# Altium schematic sheet STM8L-Controller.SchDoc
size A2
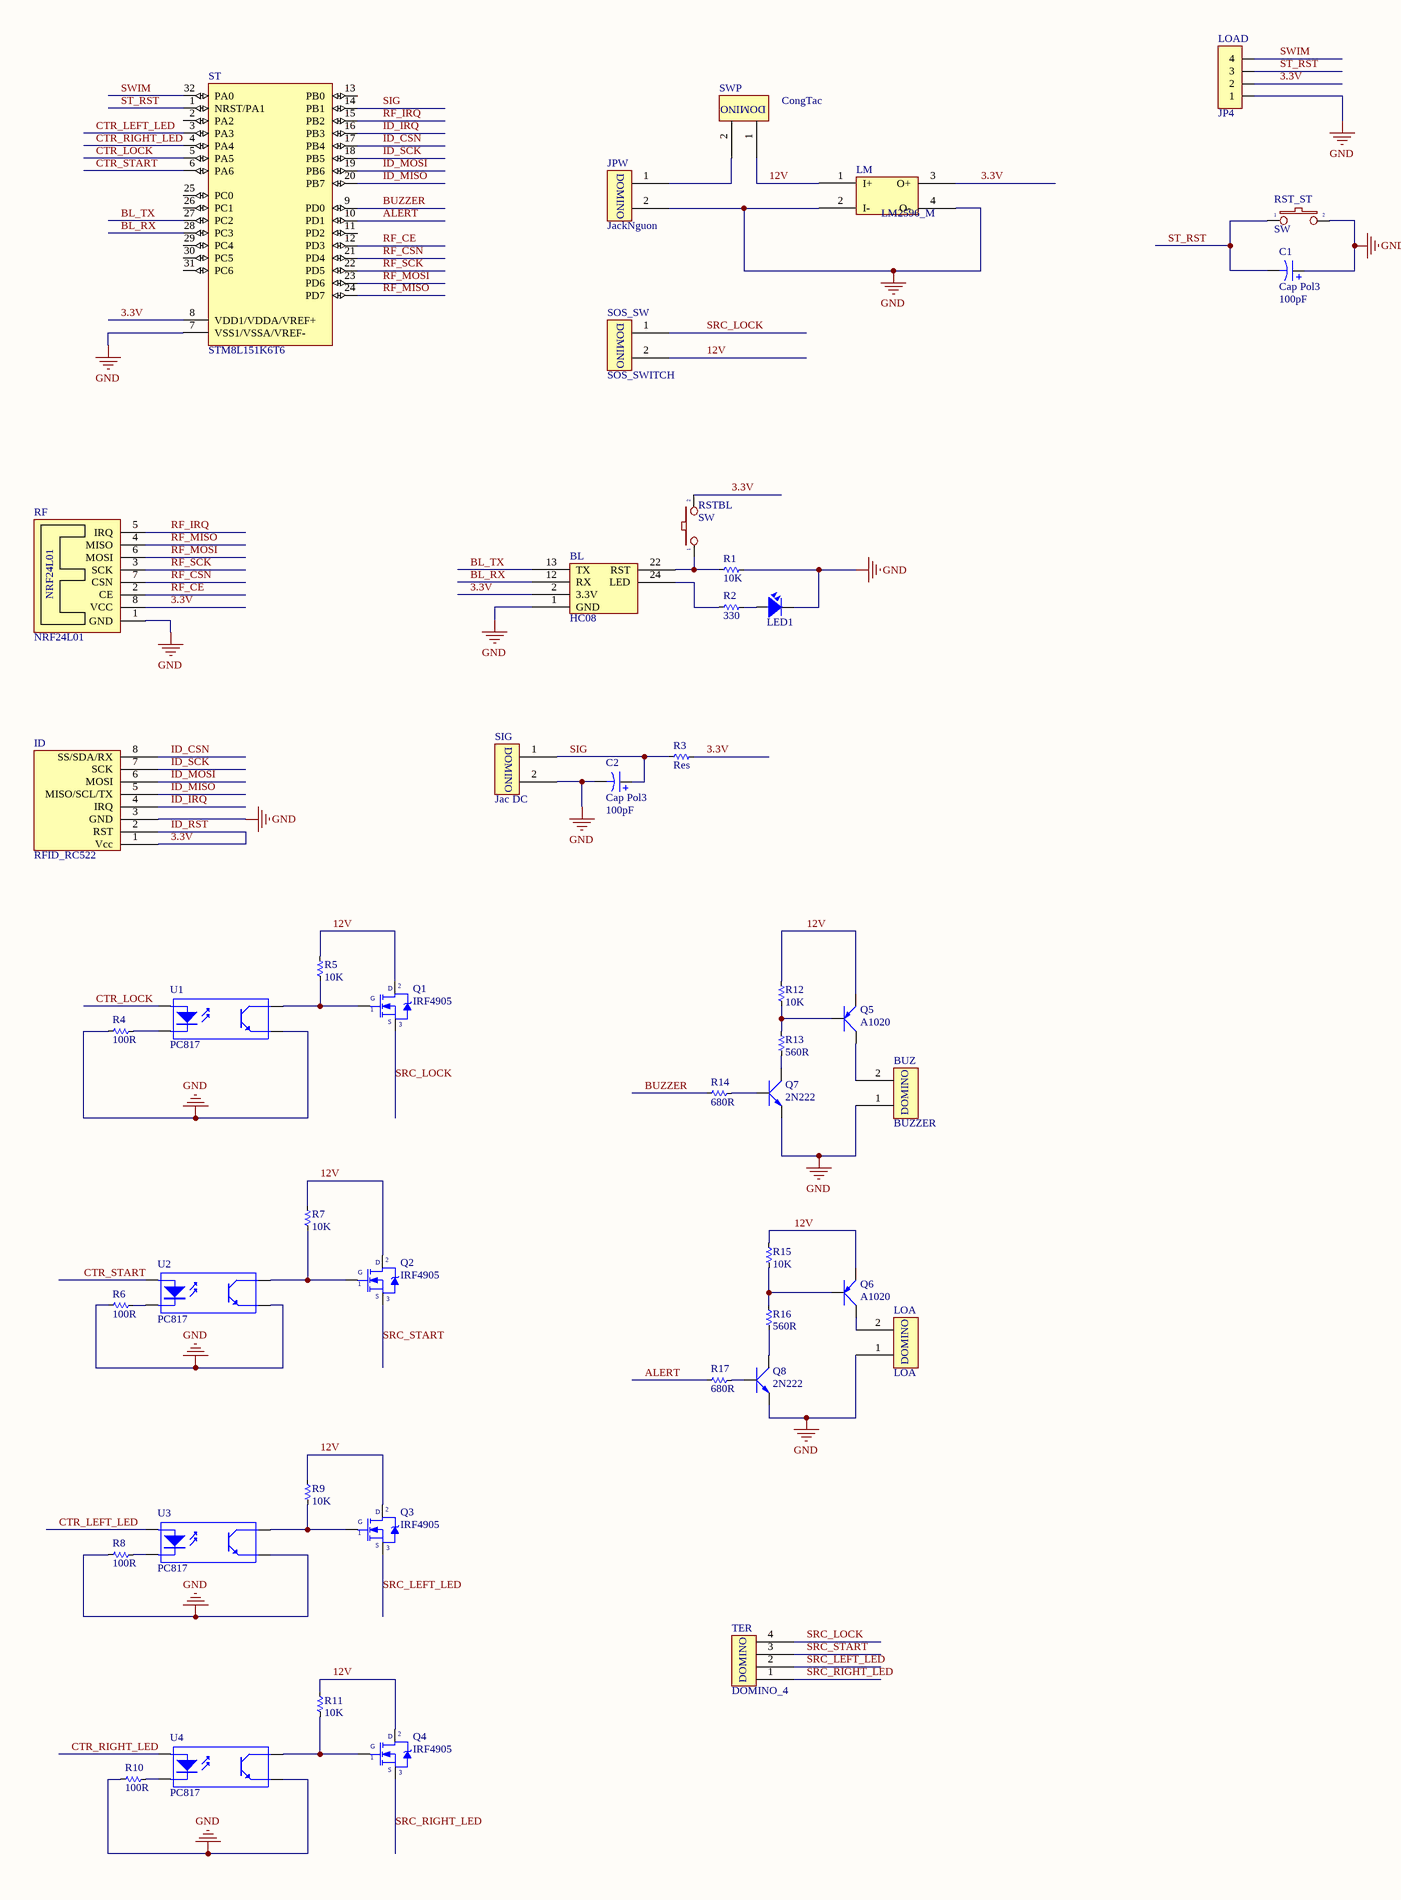
[diagram p0: STM8L-Controller.SchDoc, left]
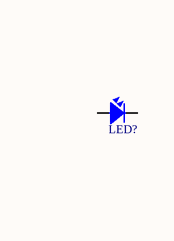
[diagram p1: STM8L-Controller.SchDoc, right]

## Parts
BL  HC08  [HC08]
BUZ  BUZZER  [DOMINO_2_5]
C1  Cap Pol3  value 100pF  [C0805]
C2  Cap Pol3  value 100pF  [C0805]
ID  RFID_RC522  [RFID_RC522]
JPW  JackNguon  [DOMINO_2_5]
LED1  LED  [LED-0805-Blue]  (value not drawn)
LED?  LED  [LED-0805-Blue]  (value not drawn)
LM  LM2596_M  [LM2596_M]
LOA  LOA  [DOMINO_2_5]
LOAD  JP4  [JP4-C1T]
Q1  IRF4905  [TO220H1]
Q2  IRF4905  [TO220H1]
Q3  IRF4905  [TO220H1]
Q4  IRF4905  [TO220H1]
Q5  A1020  [TO92-123]
Q6  A1020  [TO92-123]
Q7  2N222  [TO92-123]
Q8  2N222  [TO92-123]
R1  10K  [RES-SMD-0805]
R2  330  [RES-SMD-0805]
R3  Res  [RES-SMD-0805]
R4  100R  [RES-SMD-0805]
R5  10K  [RES-SMD-0805]
R6  100R  [RES-SMD-0805]
R7  10K  [RES-SMD-0805]
R8  100R  [RES-SMD-0805]
R9  10K  [RES-SMD-0805]
R10  100R  [RES-SMD-0805]
R11  10K  [RES-SMD-0805]
R12  10K  [RES-SMD-0805]
R13  560R  [RES-SMD-0805]
R14  680R  [RES-SMD-0805]
R15  10K  [RES-SMD-0805]
R16  560R  [RES-SMD-0805]
R17  680R  [RES-SMD-0805]
RF  NRF24L01  [NRF24L01]
RST_ST  SW  [SW1-SMD]
RSTBL  SW  [SW1-SMD]
SIG  Jac DC  [DOMINO_2_5]
SOS_SW  SOS_SWITCH  [DOMINO_2_5]
ST  STM8L151K6T6  [LQFP32_N]
SWP  CongTac  [DOMINO_2_5]
TER  DOMINO_4  [DOMINO_4_5]
U1  PC817  [DIP-4]
U2  PC817  [DIP-4]
U3  PC817  [DIP-4]
U4  PC817  [DIP-4]

## Nets
GND: BL.1(GND) BUZ.1 C1.1 C2.2 ID.3(GND) JPW.2 LED1.2 LM.2(I-) LM.4(O-) LOA.1 LOAD.1 Q7.1(E) Q8.1(E) R1.1 R4.1 R6.1 R8.1 R10.1 RF.1(GND) RST_ST.2 SIG.2 ST.7(VSS1/VSSA/VREF-) U1.3(E) U2.3(E) U3.3(E) U4.3(E)
3.3V: BL.2(3.3V) ID.1(Vcc) ID.2(RST) LM.3(O+) LOAD.2 R3.1 RF.8(VCC) RSTBL.2 ST.8(VDD1/VDDA/VREF+)  [also labelled ID_RST]
12V: LM.1(I+) Q1.2(D) Q2.2(D) Q3.2(D) Q4.2(D) Q5.1(E) Q6.1(E) R5.1 R7.1 R9.1 R11.1 R12.1 R15.1 SOS_SW.2 SWP.1
ALERT: R17.1 ST.10(PD1)
BL_RX: BL.12(RX) ST.28(PC3)
BL_TX: BL.13(TX) ST.27(PC2)
BUZZER: R14.1 ST.9(PD0)
CTR_LEFT_LED: ST.3(PA3) U3.1(A)
CTR_LOCK: ST.5(PA5) U1.1(A)
CTR_RIGHT_LED: ST.4(PA4) U4.1(A)
CTR_START: ST.6(PA6) U2.1(A)
ID_CSN: ID.8(SS/SDA/RX) ST.17(PB4)
ID_IRQ: ID.4(IRQ) ST.16(PB3)
ID_MISO: ID.5(MISO/SCL/TX) ST.20(PB7)
ID_MOSI: ID.6(MOSI) ST.19(PB6)
ID_SCK: ID.7(SCK) ST.18(PB5)
RF_CE: RF.2(CE) ST.12(PD3)
RF_CSN: RF.7(CSN) ST.21(PD4)
RF_IRQ: RF.5(IRQ) ST.15(PB2)
RF_MISO: RF.4(MISO) ST.24(PD7)
RF_MOSI: RF.6(MOSI) ST.23(PD6)
RF_SCK: RF.3(SCK) ST.22(PD5)
SIG: C2.1 R3.2 SIG.1 ST.14(PB1)
SRC_LEFT_LED: Q3.3(S) TER.2
SRC_LOCK: Q1.3(S) SOS_SW.1 TER.4
SRC_RIGHT_LED: Q4.3(S) TER.1
SRC_START: Q2.3(S) TER.3
ST_RST: C1.2 LOAD.3 RST_ST.1 ST.1(NRST/PA1)
SWIM: LOAD.4 ST.32(PA0)
NetBL_22: BL.22(RST) R1.2 RSTBL.1
NetBL_24: BL.24(LED) R2.2
NetBUZ_2: BUZ.2 Q5.3(C)
NetJPW_1: JPW.1 SWP.2
NetLED1_1: LED1.1 R2.1
NetLOA_2: LOA.2 Q6.3(C)
NetQ1_1: Q1.1(G) R5.2 U1.4(C)
NetQ2_1: Q2.1(G) R7.2 U2.4(C)
NetQ3_1: Q3.1(G) R9.2 U3.4(C)
NetQ4_1: Q4.1(G) R11.2 U4.4(C)
NetQ5_2: Q5.2(B) R12.2 R13.1
NetQ6_2: Q6.2(B) R15.2 R16.1
NetQ7_2: Q7.2(B) R14.2
NetQ7_3: Q7.3(C) R13.2
NetQ8_2: Q8.2(B) R17.2
NetQ8_3: Q8.3(C) R16.2
NetR4_2: R4.2 U1.2(K)
NetR6_2: R6.2 U2.2(K)
NetR8_2: R8.2 U3.2(K)
NetR10_2: R10.2 U4.2(K)

Not connected (* = marked no-connect by the designer): LED? 1 2; ST 2(PA2) 11(PD2) 13(PB0) 25(PC0) 26(PC1) 29(PC4) 30(PC5) 31(PC6)

## Notes on the sheet
- (in symbol Domino_2) DOMINO
- (in symbol DOMINO_4) DOMINO

## Library data of the parts
BL = HC08: module hc08-hc05; Value: Jac DC
BUZ JPW LOA SOS_SW SWP = Domino_2: Domino 2; Value: Jac DC
C1 C2 = Cap Pol3: Polarized Capacitor (Surface Mount); Published: 8-Jun-2000; LatestRevisionDate: 29-May-2009; LatestRevisionNote: IPC-7351 Footprint Added.; PackageReference: C0805; Publisher: Altium Limited; PackageDescription: Chip Capacitor
ID = RFID_RC522: Module RFID RC522; Value: Jac DC
LED1 LED? = LED SMD: Value: LED 3 - 5 ly 2 Colour
LM = LM2596_M: module nguon lm2596; Value: Jac DC
LOAD = JP4: WR-PHD 2.54 mm Angled Socket Header; Manufacturer: W¨¹rth Elektronik eiSos GmbH; partNo: 613004143121; ComponentLink1 Description: Manufacturer; ComponentLink2 Description: Datasheet; NoPins: 04; Created Date: 29 March 2013; ComponentLink1URL: http://www.we-online.com; ComponentLink2URL: http://katalog.we-online.de/em/datasheet/6130xx143121.pdf; Created by: Karrer Zheng
Q1-Q4 = IRF840: MOSFET N - CHANNEL 500V - 0.75 - 8A - TO-220; Value: IRF840
Q5 Q6 = 2N3906: PNP 600mW, ECB; Value: A1015
Q7 Q8 = 2N222: NPN 600mW, ECB; Value: C1815
R1-R17 = Res-SMD: Resistor; Manufacturer: Generic Components; Class: Passive; Published: 08/06/2000; Publisher: Altium Hobart Technology Centre
RST_ST RSTBL = SW2: Switch button 2 pin; Value: SW chip 2 pin
SIG = Domino_2: Domino 2; Value: Jac DC
ST = STM8L151K6T6: STM8L ARM-based EnergyLite 8-bit MCU, 32 kB Flash, 2 kB Internal RAM, -40 to +85°C Temperature, 32-pin LQFP, Tray; PackageVersion: 2010; PackageReference: LQFP32; PackageDescription: 32-Pin Low Profile Quad Flat Pack, 7 x 7 mm Body, 0.8 mm Pitch; ComponentLink1Description: Manufacturer URL; ComponentLink1URL: http://www.st.com/; ComponentLink2Description: STM8L151/152,x4,x6 Datasheet; ComponentLink2URL: http://www.st.com/internet/com/TECHNICAL_RESOURCES/TECHNICAL_LITERATURE/DATASHEET/CD00240181.pdf; ComponentLink3Description: STM8L Family Web Page; ComponentLink3URL: http://www.st.com/internet/mcu/subclass/1381.jsp
TER = DOMINO_4: DOMINO 4P; Value: Jac DC
U1-U4 = Optoisolator1: 4-Pin Phototransistor Optocoupler; Published: 24-Mar-1999; LatestRevisionDate: 04-Mar-2005; LatestRevisionNote: Sch pins 3 & 4 Swapped.; DatasheetVersion: Nov-2003; PackageReference: DIP-4; Publisher: Altium Limited